# EAGLE design BEP31_Test_Interface4_Seed (EAGLE 6.4)

## Sheet 1 of 3
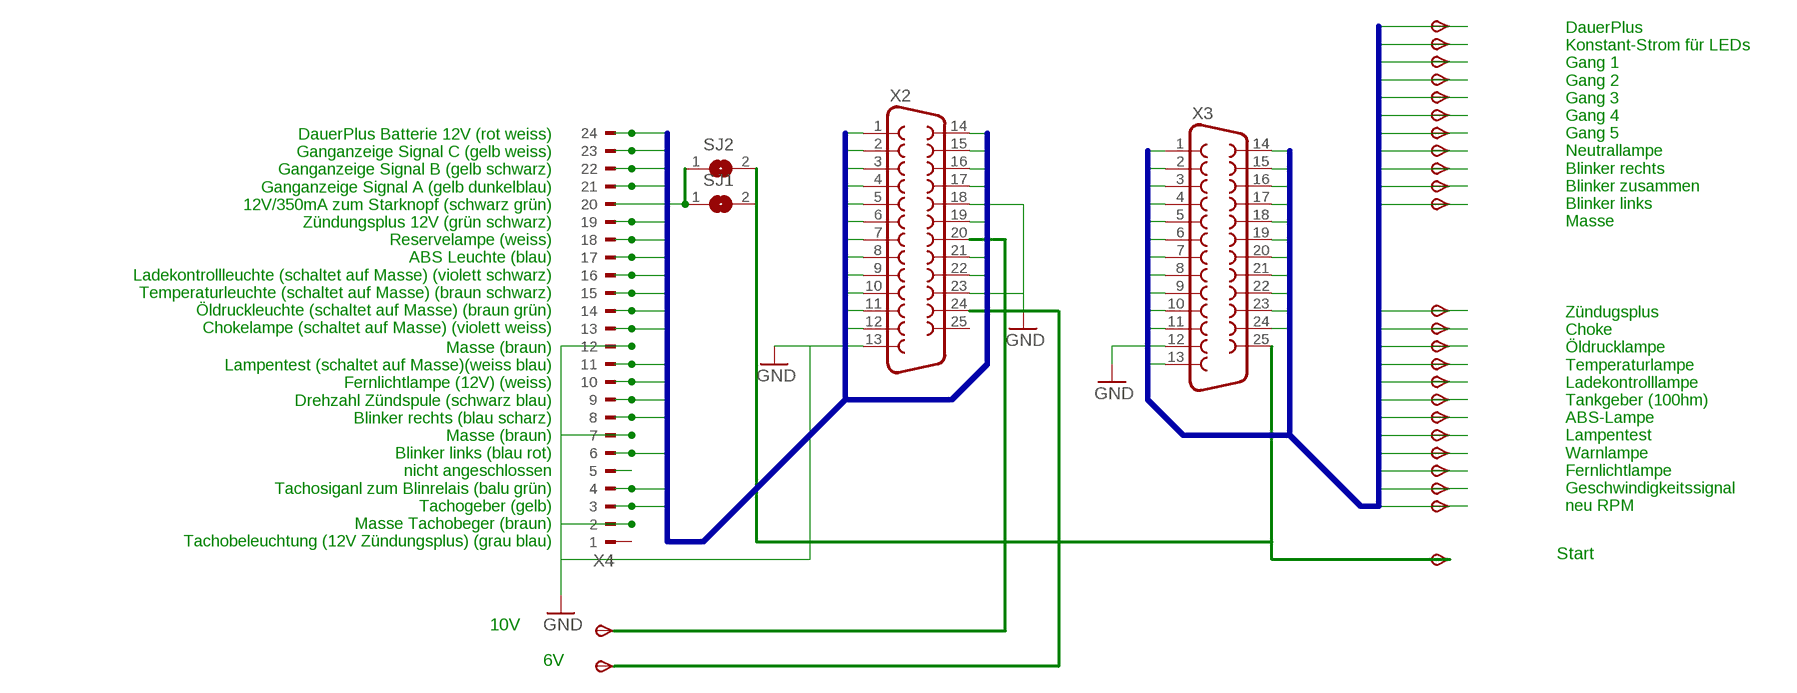
[diagram p0: schematic, sheet 1]

### Parts
SJ1  SJ  [SJ]
SJ2  SJ  [SJ]
TP1  TPSFEDERPIN  [1,36ID]
TP2  TPSFEDERPIN  [1,36ID]
TP3  TPSFEDERPIN  [1,36ID]
TP4  TPSFEDERPIN  [1,36ID]
TP5  TPSFEDERPIN  [1,36ID]
TP6  TPSFEDERPIN  [1,36ID]
TP7  TPSFEDERPIN  [1,36ID]
TP8  TPSFEDERPIN  [1,36ID]
TP9  TPSFEDERPIN  [1,36ID]
TP10  TPSFEDERPIN  [1,36ID]
TP11  TPSFEDERPIN  [1,36ID]
TP12  TPSFEDERPIN  [1,36ID]
TP13  TPSFEDERPIN  [1,36ID]
TP14  TPSFEDERPIN  [1,36ID]
TP15_10V  TPSFEDERPIN  [1,36ID]
TP16  TPSFEDERPIN  [1,36ID]
TP17  TPSFEDERPIN  [1,36ID]
TP18  TPSFEDERPIN  [1,36ID]
TP19  TPSFEDERPIN  [1,36ID]
TP20_6V  TPSFEDERPIN  [1,36ID]
TP21  TPSFEDERPIN  [1,36ID]
TP22  TPSFEDERPIN  [1,36ID]
TP23  TPSFEDERPIN  [1,36ID]
TP24  TPSFEDERPIN  [1,36ID]
TP25  TPSFEDERPIN  [1,36ID]
TP26  TPSFEDERPIN  [1,36ID]
X2  F25H  [F25H]
X3  F25H  [F25H]
X4  CON_BMWTESTPINS  [24-TESTPIN_1,36ID]

### Nets
BMW1: X2.1 X4.P24
BMW2: X2.2 X4.P23
BMW3: X2.3 X4.P22
BMW4: X2.4 X4.P21
BMW5: SJ1.1 SJ2.1 X2.5 X4.P20
BMW6: X2.6 X4.P19
BMW7: X2.7 X4.P18
BMW8: X2.8 X4.P17
BMW9: X2.9 X4.P16
BMW10: X2.10 X4.P15
BMW11: X2.11 X4.P14
BMW12: X2.12 X4.P13
BMW14: X2.14 X4.P11
BMW15: X2.15 X4.P10
BMW16: X2.16 X4.P9
BMW17: X2.17 X4.P8
BMW19: X2.19 X4.P6
BMW21: X2.21 X4.P4
BMW22: X2.22 X4.P3
BMW24: TP15_10V.P$1(PP) X2.20
GND: X2.13 X2.18 X2.23 X3.12 X4.P2 X4.P7 X4.P12 ; also sheet 3
N$1: X4.P5
N$97: SJ1.2 SJ2.2 TP14.P$1(PP) X3.25
N$100: TP20_6V.P$1(PP) X2.24
WAGO1: TP1.P$1(PP) X3.1
WAGO2: TP2.P$1(PP) X3.2
WAGO3: TP3.P$1(PP) X3.3
WAGO4: TP4.P$1(PP) X3.4
WAGO5: TP5.P$1(PP) X3.5
WAGO6: TP6.P$1(PP) X3.6
WAGO7: TP7.P$1(PP) X3.7
WAGO8: TP8.P$1(PP) X3.8
WAGO9: TP9.P$1(PP) X3.9
WAGO10: TP10.P$1(PP) X3.10
WAGO11: TP11.P$1(PP) X3.11
WAGO13: TP12.P$1(PP) X3.13
WAGO14: TP16.P$1(PP) X3.14
WAGO15: TP17.P$1(PP) X3.15
WAGO16: TP18.P$1(PP) X3.16
WAGO17: TP19.P$1(PP) X3.17
WAGO18: TP21.P$1(PP) X3.18
WAGO19: TP22.P$1(PP) X3.19
WAGO20: TP23.P$1(PP) X3.20
WAGO21: TP24.P$1(PP) X3.21
WAGO22: TP25.P$1(PP) X3.22
WAGO23: TP26.P$1(PP) X3.23
WAGO24: TP13.P$1(PP) X3.24
Unconnected: X2.25 X4.P1

### Buses
BMW[1..24]
WAGO[1..24]

### Notes on the sheet
- DauerPlus
  Konstant-Strom für LEDs
  Gang 1
  Gang 2
  Gang 3
  Gang 4
  Gang 5
  Neutrallampe
  Blinker rechts
  Blinker zusammen
  Blinker links
  Masse
- DauerPlus Batterie 12V (rot weiss)
  Ganganzeige Signal C (gelb weiss)
  Ganganzeige Signal B (gelb schwarz)
  Ganganzeige Signal A (gelb dunkelblau)
  12V/350mA zum Starknopf (schwarz grün)
  Zündungsplus 12V (grün schwarz)
  Reservelampe (weiss)
  ABS Leuchte (blau)
  Ladekontrollleuchte (schaltet auf Masse) (violett schwarz)
  Temperaturleuchte (schaltet auf Masse) (braun schwarz)
  Öldruckleuchte (schaltet auf Masse) (braun grün)
  Chokelampe (schaltet auf Masse) (violett weiss)
- Zündugsplus
  Choke
  Öldrucklampe
  Temperaturlampe
  Ladekontrolllampe
  Tankgeber (100hm)
  ABS-Lampe
  Lampentest
  Warnlampe
  Fernlichtlampe
  Geschwindigkeitssignal
  neu RPM
- Masse (braun)
  Lampentest (schaltet auf Masse)(weiss blau)
  Fernlichtlampe (12V) (weiss)
  Drehzahl Zündspule (schwarz blau)
  Blinker rechts (blau scharz)
  Masse (braun)
  Blinker links (blau rot)
  nicht angeschlossen
  Tachosiganl zum Blinrelais (balu grün)
  Tachogeber (gelb)
  Masse Tachobeger (braun)
  Tachobeleuchtung (12V Zündungsplus) (grau blau)
- Start
- 10V
- 6V

## Sheet 2 of 3
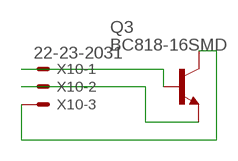
[diagram p1: schematic, sheet 2]

### Parts
Q3  BC818-16SMD  [SOT23-BEC]
X10  22-23-2031  [22-23-2031]

### Nets
N$144: Q3.B X10.1
N$145: Q3.E X10.2
N$146: Q3.C X10.3

## Sheet 3 of 3
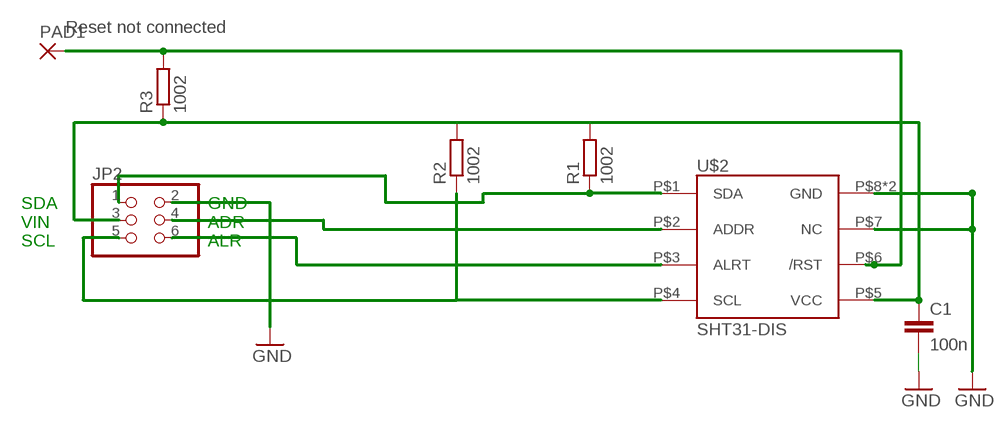
[diagram p2: schematic, sheet 3]

### Parts
C1  100n  C-EUC0805K  [C0805K]
JP2  PINHD-2X3  [2X03]
PAD1  1,6/0,8  [1,6/0,8]
R1  1002  R-EU_R0805  [R0805]
R2  1002  R-EU_R0805  [R0805]
R3  1002  R-EU_R0805  [R0805]
U$2  SHT31-DIS  [SHT3X]

### Nets
GND: C1.2 JP2.2 U$2.P$7(NC) U$2.P$8(GND) U$2.PAD(GND) ; also sheet 1
N$119: C1.1 JP2.3 R1.2 R2.2 R3.1 U$2.P$5(VCC)
N$120: JP2.5 R2.1 U$2.P$4(SCL)
N$121: JP2.1 R1.1 U$2.P$1(SDA)
N$122: JP2.4 U$2.P$2(ADDR)
N$123: JP2.6 U$2.P$3(ALRT)
N$124: PAD1.1(P) R3.2 U$2.P$6(/RST)

### Notes on the sheet
- Reset not connected
- SDA
  VIN
  SCL
- GND
  ADR
  ALR

## Library data of the parts
C1 = rcl:C-EU: CAPACITOR, European symbol
JP2 = pinhead:PINHD-2X3: PIN HEADER
PAD1 = wirepad:1,6/0,8: THROUGH-HOLE PAD
Q3 = transistor-npn:BC818*: NPN Transistor
R1-R3 = rcl:R-EU_: RESISTOR, European symbol
SJ1 SJ2 = jumper:SJ: SMD solder JUMPER
TP1-TP14 TP15_10V TP16-TP19 TP20_6V TP21-TP26 = testpin_BMW:TPS: TEST PIN
U$2 = sht31_sensirion:SHT31-DIS
X2 X3 = con-subd:F25: SUB-D; OC_FARNELL: unknown; OC_NEWARK: unknown
X4 = con_BMW:CON_BMW: BMW CONNECTOR
X10 = con-molex:22-23-2031: .100" (2.54mm) Center Header - 3 Pin; MF: MOLEX; MPN: 22-23-2031; OC_FARNELL: 1462950; OC_NEWARK: 30C0862

## Board
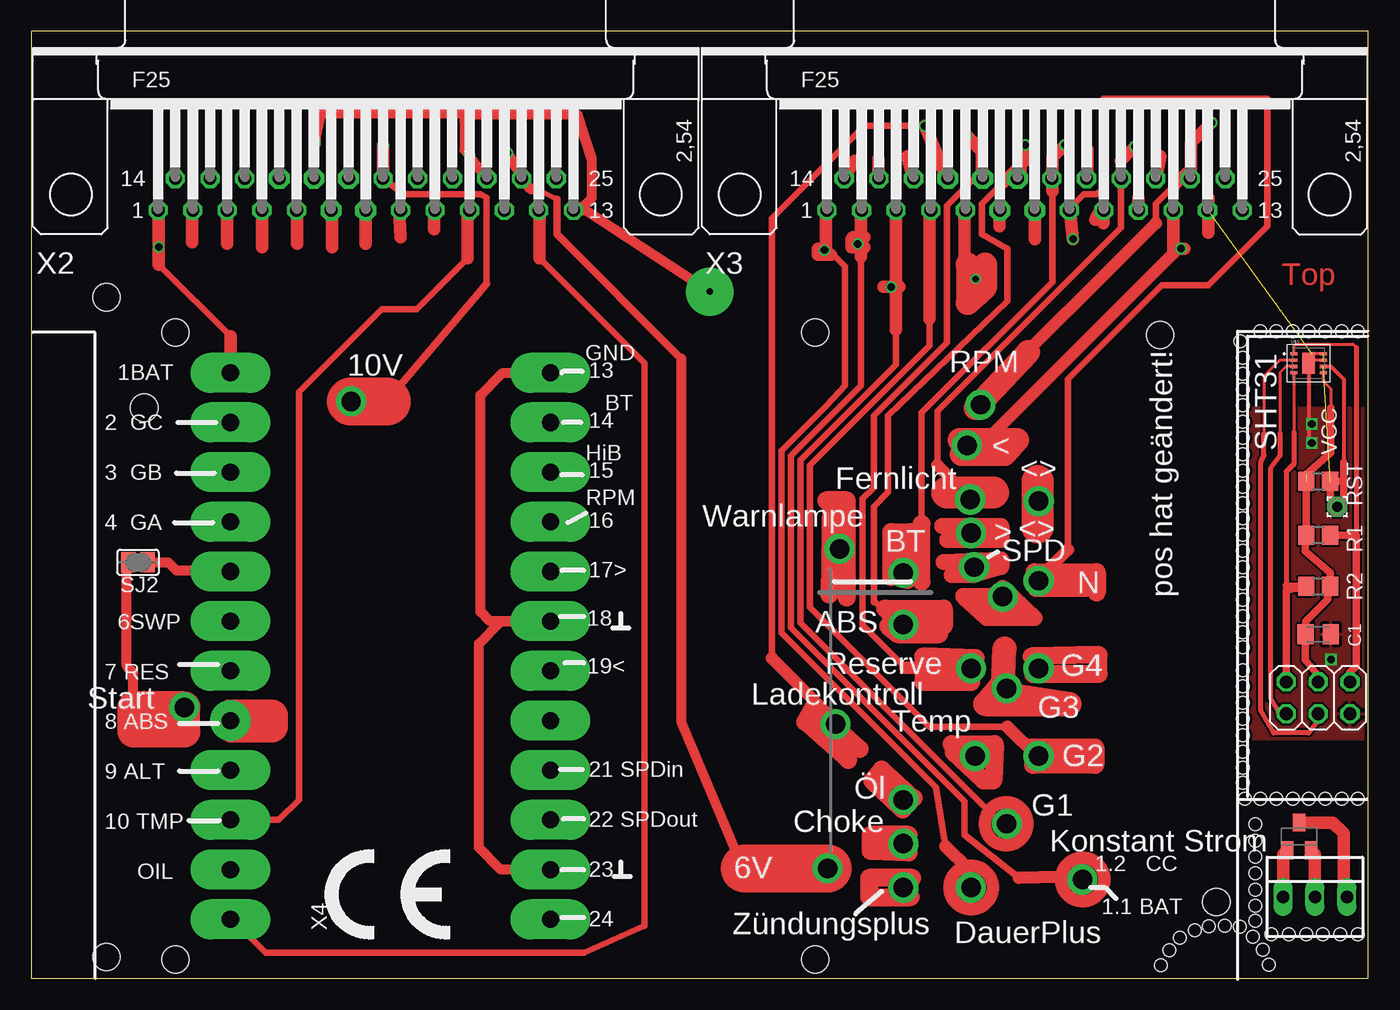
[diagram p3: board, top side]
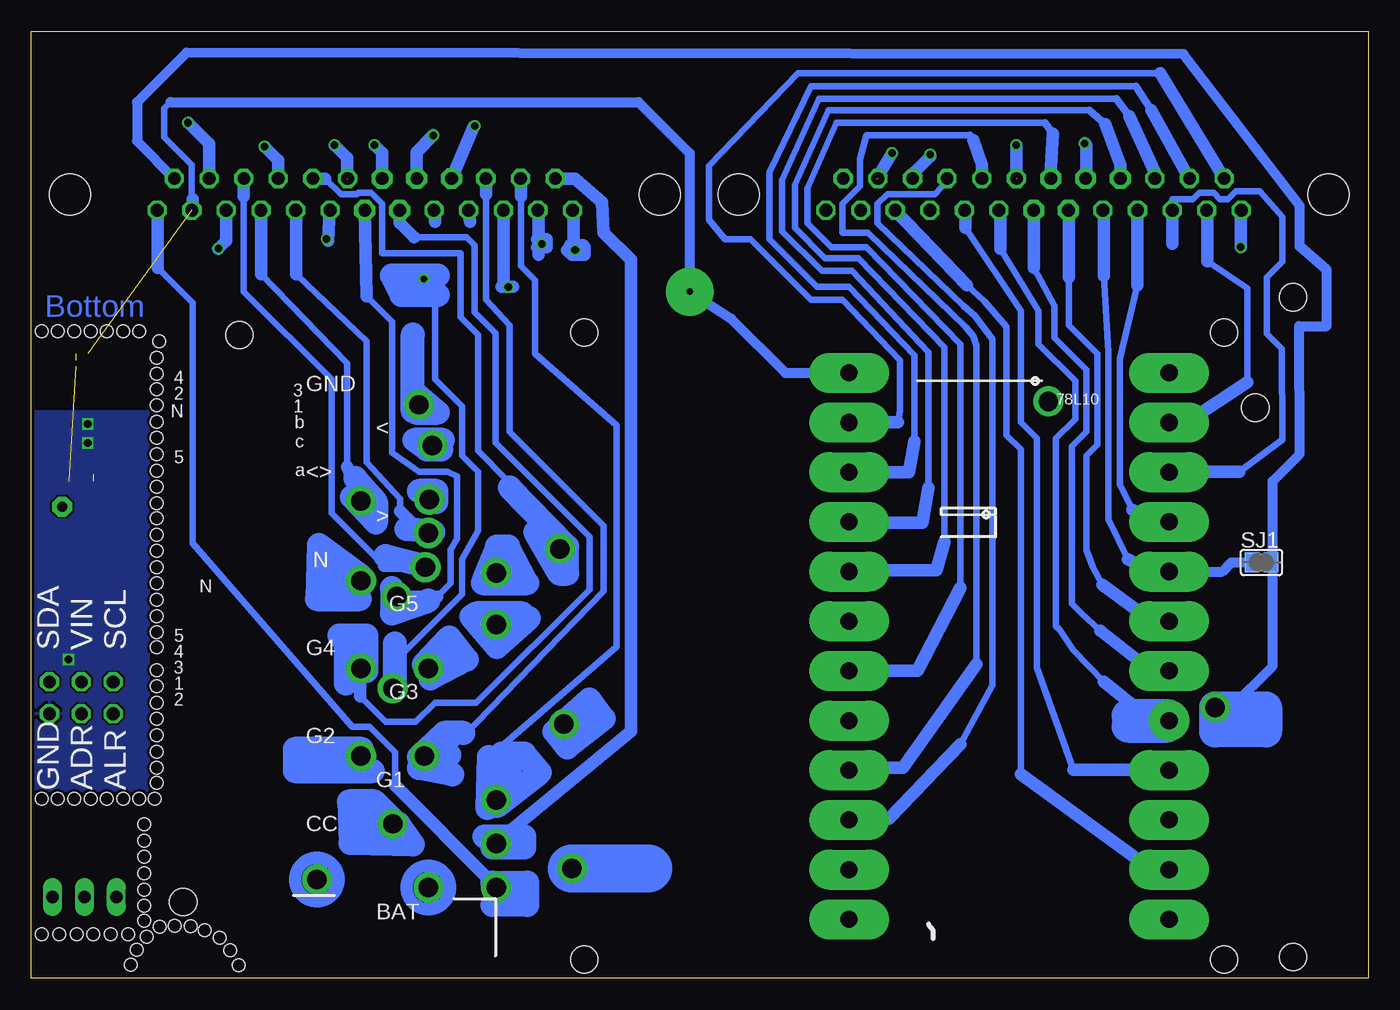
[diagram p4: board, bottom side, seen from below]

Size 106.6 x 75.5 mm. Coordinates in mm from the lower left corner, seen from the top.
Outline: 106.6,14.51 106.6,51.32
Outline: 106.6,75.5 0,75.5 0,0 106.6,0 106.6,75.5
Copper layers (1*16): Top 0.035mm / dielectric 1.5mm / Bottom 0.035mm
Design rules "SeeedStudio_2layer_DRU_no_angle_20140221": minimum track width 6mil, minimum drill 12mil, track to track 6mil, track to pad 6mil, pad to pad 6mil, via to via 6mil, smd to smd 0mil, copper to edge 10mil, drill to drill 10mil, minimum pad ring 10mil, minimum via ring 6mil, stop-mask expansion 2mil, vias tented up to drill 100mil, thermal gap 10mil
Holes 1.02 mm at 95.19,4.21 93.92,4.14 92.77,3.83 91.57,3.25 90.76,2.27 90.06,1.07 96.39,4.11 97.39,3.31 98.19,2.31 98.69,1.11 96.79,14.31 97.99,14.31 99.29,14.31 100.59,14.31 101.89,14.31 103.19,14.31 104.49,14.31 105.79,14.31 97.59,4.59 97.59,5.79 97.59,7.09 97.59,8.39 97.59,9.69 97.59,10.99 97.59,12.29 96.59,15.59 96.59,16.79 96.59,18.09 96.59,19.39 96.59,20.69 96.59,21.99 96.59,23.29 96.59,24.59 96.59,26.39 96.59,27.59 96.59,28.89 96.59,30.19 96.59,31.49 96.59,32.79 96.59,34.09 96.59,35.39 96.59,36.69 96.59,37.89 96.59,39.19 96.59,40.49 96.59,41.79 96.59,43.09 96.59,44.39 96.59,45.69 97.99,51.61 99.29,51.61 100.59,51.61 101.89,51.61 103.19,51.61 104.49,51.61 105.79,51.61 96.59,46.99 96.59,48.19 96.59,49.49 96.39,50.79 98.89,3.51 100.29,3.51 101.69,3.51 102.99,3.51 104.39,3.51 105.79,3.51
Holes 2.18 mm at 94.5,6.1 9,45.5 11.5,51.5 62.5,51.5 11.5,1.5 62.5,1.5 94.5,6.1 6,1.7 90,51.3 6,54.3
tRestrict: area 62.5,59.6 to 92.2,65; area 103.9,48.3 to 104.9,49
bRestrict: area 9.1,47.9 to 38.2,61.9; area 11.2,63.1 to 20.1,65.5; area 19,65.8 to 37.2,68.8; area 62.4,59.6 to 92.2,65.2

### Footprints (pad centres in the part's own frame; a part is rotated, then mirrored left to right if it is on the bottom)
C0805K = smd 1.3 x 1.6: 1 -1,0; 2 1,0
2X03 = drill 1.016 octagon: 1 -2.54,-1.27; 2 -2.54,1.27; 3 0,-1.27; 4 0,1.27; 5 2.54,-1.27; 6 2.54,1.27
1,6/0,8 = drill 0.813 pad 1.6 octagon: 1 0,0
SOT23-BEC = smd 1 x 1.4: B -0.95,-1.1; C 0,1.1; E 0.95,-1.1
R0805 = smd 1.3 x 1.5: 1 -0.95,0; 2 0.95,0
SJ = smd 1.168 x 1.6: 1 -0.762,0; 2 0.762,0
1,36ID = drill 1.55 pad 2.4: P$1 0,0
SHT3X = smd 0.55 x 0.25: P$1 -1.175,0.75; P$2 -1.175,0.25; P$3 -1.175,-0.25; P$4 -1.175,-0.75; P$5 1.175,-0.75; P$6 1.175,-0.25; P$7 1.175,0.25; P$8 1.175,0.75 | smd 1 x 1.7: PAD 0,0
F25H = drill 1.016 octagon: 1 -16.561,-1.27; 2 -13.792,-1.27; 3 -11.049,-1.27; 4 -8.28,-1.27; 5 -5.512,-1.27; 8 2.769,-1.27; 9 5.512,-1.27; 10 8.28,-1.27; 11 11.049,-1.27; 12 13.792,-1.27; 13 16.561,-1.27; 14 -15.189,1.27; 15 -12.421,1.27; 16 -9.652,1.27; 20 1.372,1.27; 21 4.14,1.27; 22 6.909,1.27; 23 9.652,1.27; 24 12.421,1.27; 25 15.189,1.27 | drill 1.016 pad 1.67 octagon: 6 -2.769,-1.27; 7 0,-1.27; 17 -6.909,1.27; 18 -4.14,1.27; 19 -1.372,1.27 | hole 3.302: -23.52,0; 23.52,0
24-TESTPIN_1,36ID = drill 1.36 pad 3.2 long: P1 -21.78,-12.76; P2 -17.82,-12.76; P3 -13.86,-12.76; P4 -9.9,-12.76; P5 -5.94,-12.76; P6 -1.98,-12.76; P7 1.98,-12.76; P8 5.94,-12.76; P9 9.9,-12.76; P10 13.86,-12.76; P11 17.82,-12.76; P12 21.78,-12.76; P13 -21.78,12.76; P14 -17.82,12.76; P15 -13.86,12.76; P16 -9.9,12.76; P18 -1.98,12.76; P19 1.98,12.76; P20 5.94,12.76; P21 9.9,12.76; P22 13.86,12.76; P23 17.82,12.76; P24 21.78,12.76 | drill 1.36 pad 3.2: P17 -5.94,12.76
22-23-2031 = drill 1 long: 1 -2.54,0; 2 0,0; 3 2.54,0

### Placement (x,y rotation side)
C1  102.62,27.45 0 top
JP2  102.62,22.37 180 top
PAD1  104.14,37.61 270 top
Q3  101.09,11.32 0 top
R1  102.62,35.32 180 top
R2  102.62,31.26 0 top
R3  102.62,39.64 0 top
SJ1  8.51,33.16 0 bottom
SJ2  8.51,33.16 180 top
TP1  74.93,7.26 0 bottom
TP2  83.82,7.89 0 bottom
TP3  77.79,12.34 0 bottom
TP4  80.33,17.73 0 bottom
TP5  77.79,23.13 0 bottom
TP6  80.33,24.72 0 bottom
TP7  77.47,30.43 0 bottom
TP8  80.33,31.7 0 bottom
TP9  74.93,35.51 0 bottom
TP10  80.33,38.05 0 bottom
TP11  74.61,42.5 0 bottom
TP12  69.53,7.26 0 bottom
TP13  75.69,45.74 0 bottom
TP14  12.19,21.61 0 top
TP15_10V  25.5,46 0 top
TP16  69.53,10.75 0 bottom
TP17  69.53,14.24 0 bottom
TP18  75.25,17.73 0 bottom
TP19  64.14,20.27 0 bottom
TP20_6V  63.5,8.78 0 top
TP21  74.93,24.72 0 bottom
TP22  69.53,28.21 0 bottom
TP23  69.53,32.34 0 bottom
TP24  64.45,34.24 0 bottom
TP25  74.87,38.18 0 bottom
TP26  75.18,32.78 0 bottom
U$1  [CE_10.00]  23.37,3.06 0 top
U$2  101.85,49.04 0 top
X2  26.67,62.5 0 top
X3  80.01,62.5 0 top
X4  28.64,26.5 90 top
X10  102.36,6.49 0 top

### Tracks (layer width: path | path; a pad name or v marks a point on that pad's centre or on a via)
BMW1  (via drill 0.6)
  Top 0.508: 15.88,51.2 10.16,56.91 | 10.16,61.23 X2.1
  Top 1.016: 10.16,56.91 v10.16,58.31 10.16,61.23 | X4.P24 15.88,51.2
  Bottom 1.016: 10.16,61.23 v10.16,58.31
BMW2
  Bottom 0.508: 12.83,57.17 9.65,55.01 9.65,47.51 | 14.48,44.34 15.88,44.34 X4.P23 | 12.83,61.23 X2.2
  Bottom 1.016: 12.83,57.17 12.83,61.23 | 14.48,44.34 9.65,47.51
BMW3
  Bottom 0.508: 15.62,58.56 15.62,62.12 13.97,62.12 13.46,62.63 12.32,62.63 11.81,62.12 11.18,62.12 10.54,62.75 8.64,62.75 6.86,60.72 6.86,57.14 8.1,55.9 8.1,51.4 6.9,50.2 6.86,42.94 10.29,40.4 | 15.88,40.4 X4.P22
  Bottom 1.016: 15.62,58.56 X2.3 | 15.88,40.4 10.29,40.4
BMW4
  Bottom 0.508: 18.41,55.26 19.81,49.42 19.81,39.39 18.8,37.35 | 17.4,36.47 15.88,36.47 X4.P21 | 18.41,61.23 X2.4
  Bottom 1.016: 18.41,55.26 18.41,61.23 | 17.4,36.47 18.8,37.35
BMW5  (1 unrouted)
  Top 0.813: SJ2.1 10.92,33.16 11.56,32.53 15.88,32.53
  Bottom 0.508: 19.18,33.42 20.7,36.59 20.7,49.93 21.08,56.02 | 17.4,32.53 15.88,32.53 X4.P20 | 21.08,61.23 X2.5
  Bottom 0.813: X4.P20 11.64,32.44 10.92,33.16 SJ2.1
  Bottom 1.016: 21.08,56.02 21.08,61.23 | 17.4,32.53 19.18,33.42
BMW6
  Bottom 0.508: 23.88,55.9 23.88,52.09 21.59,49.8 21.59,42.56 22.48,41.67 22.48,34.18 21.97,32.78 21.21,31.38 | 17.4,28.59 15.88,28.59 X4.P19 | 23.88,61.23 X2.6
  Bottom 1.016: 23.88,55.9 23.88,61.23 | 17.4,28.59 21.21,31.38
BMW7
  Bottom 0.508: 26.67,56.66 25.02,53.61 25.02,51.07 22.48,48.53 22.48,43.58 23.62,42.43 23.62,29.86 22.86,29.1 21.34,27.7 | 17.27,24.53 X4.P18
  Bottom 1.016: 26.67,56.66 X2.7 | 17.27,24.53 21.34,27.7
BMW8
  Bottom 0.508: 29.34,58.18 26.29,53.23 26.29,50.56 23.37,47.64 23.37,44.59 24.89,43.07 24.89,28.08 24.64,27.83 23.5,26.18 21.08,23.64 | 17.27,20.59 15.88,20.59 X4.P17 | 29.34,61.23 X2.8
  Bottom 1.016: 29.34,58.18 29.34,61.23 | 17.27,20.59 21.08,23.64
  Bottom 2.54: 15.88,20.59 15.88,20.97 19.18,20.97 19.18,20.08 16,20.08 16,20.21
BMW9
  Bottom 0.508: 32.13,59.83 27.69,53.23 27.69,44.34 26.42,43.07 26.42,24.78 23.5,16.65 | 17.27,16.65 15.88,16.65 X4.P16 | 32.13,61.23 X2.9
  Bottom 1.016: 32.13,59.83 32.13,61.23 | 17.27,16.65 23.5,16.65
BMW10
  Top 0.508: X4.P15 19.74,12.64 21.34,14.24 21.34,46.75 27.94,53.36 30.73,53.36 34.8,57.42 | 34.8,61.08 X2.10
  Top 1.016: 34.8,57.42 34.8,61.08
BMW11
  Bottom 0.508: 32,55.26 30.61,53.99 28.83,51.96 28.83,43.32 27.69,42.18 27.69,16.27 | 17.4,8.78 15.88,8.78 X4.P14
  Bottom 1.016: 32,55.26 X2.11 | 17.4,8.78 27.69,16.27
BMW12
  Top 0.508: 40.51,57.42 48.9,49.04 48.9,4.21 44.07,2.05 18.67,2.05 15.88,4.84 X4.P13 | 40.51,61.23 X2.12
  Top 1.016: 40.51,57.42 40.51,61.23
BMW14
  Bottom 0.508: 37.48,44.32 37.34,45.23 37.34,49.29 41.91,54.12 44.45,54.12 49.28,58.94 51.31,58.94 52.58,60.47 52.58,64.79 45.47,72.15 16.56,72.15
  Bottom 1.016: X4.P11 37.48,44.32 | 16.56,72.15 X2.14
BMW15
  Bottom 0.508: 36.2,42.81 36.2,49.67 41.4,55.13 43.94,55.13 47.75,58.94 47.75,64.28 44.45,71.14 18.54,71.14
  Bottom 0.61: 18.54,71.14 17.27,69.23
  Bottom 1.016: X4.P10 36.62,40.36 36.2,42.81 | 17.27,69.23 X2.15
BMW16
  Bottom 0.508: 20.07,70.12 43.81,70.12 46.74,63.64 46.74,59.58 43.56,56.4 41.15,56.4 35.05,49.93 35.05,39.13 | 41.33,36.34 X4.P9
  Bottom 0.61: 19.05,68.72 20.07,70.12
  Bottom 1.016: X2.16 17.02,64.28 19.05,68.72 | 35.05,39.13 35.56,36.34 41.33,36.34
BMW17
  Bottom 0.508: 22.23,69.23 43.05,69.23 45.72,63.26 45.72,59.83 43.31,57.42 40.64,57.42 33.78,50.31 33.78,34.81 | 41.4,32.53 41.78,32.15 41.69,32.15 X4.P8
  Bottom 0.61: 20.95,68.09 22.23,69.23
  Bottom 1.016: X2.17 19.76,64.86 20.95,68.09 | 33.78,34.81 34.42,32.53 41.4,32.53
BMW19
  Bottom 0.508: 25.78,68.22 42.42,68.22 44.7,63.01 44.7,60.21 42.8,58.31 40.01,58.31 32.51,50.56 32.51,31.13 | 41.39,24.53 X4.P6
  Bottom 0.61: 25.15,67.33 25.78,68.22
  Bottom 1.016: X2.19 25.3,64.68 25.15,67.33 | 32.51,31.13 35.94,24.53 41.39,24.53
BMW21
  Bottom 0.508: 31.75,67.2 40.01,67.2 40.51,65.29 40.51,63.14 41.91,61.74 41.91,59.45 39.88,59.45 32.13,51.96 31.5,51.2 31.24,50.44 31.24,25.04 | 41.22,16.78 X4.P4
  Bottom 0.61: 31.5,66.82 31.75,67.2
  Bottom 1.016: X2.21 30.81,64.86 31.5,66.82 | 31.24,25.04 37.08,16.78 41.22,16.78
BMW22
  Bottom 0.406: 33.53,63.77 33.53,63.64
  Bottom 0.508: 32.51,18.68 29.97,23.38 29.97,50.94 31.37,52.85 32.26,53.61 39.12,60.21 39.12,61.74 38.35,62.5 34.54,62.5 33.53,63.64 | 33.53,63.77 X2.22
  Bottom 1.016: 32.51,18.68 38.23,12.72 X4.P3
BMW24  (via drill 0.6)  (1 unrouted)
  Top 0.508: 28.07,63.77 28.19,63.64 29.72,62.5 35.81,62.5 36.32,62.25 36.32,55.39
  Top 0.61: 28.33,46 36.32,55.39
  Top 1.016: v28.07,66.44 28.07,63.77
  Top 3.81: TP15_10V.P$1 28.33,46
  Bottom 1.016: 28.04,63.8 v28.07,66.44
GND  (via drill 0.51 pad 3.81, 0.6)  (2 unrouted)
  Top 0.254: U$2.P$7 102.1,49.29 U$2.PAD | U$2.P$8 102.12,49.79 102.11,49.8
  Top 0.305: U$2.PAD 101.85,42.69 v102.11,42.69
  Top 0.813: X4.P2 37.44,8.68 35.69,10.43 35.69,26.69 37.47,28.46 41.38,28.46 X4.P7 36.56,28.48 35.81,29.23 35.81,46.5 37.59,48.28 X4.P12 | 34.54,68.34 34.8,68.85 43.56,68.85 44.7,65.29 44.7,62.25 43.69,61.23 X2.13 44.2,61.23 v54.1,54.75 | 34.54,68.34 34.54,66.06 X2.23 | X2.18 22.53,66.23 23.11,68.98 35.05,68.98 34.54,68.34
  Bottom 0.508: X3.12 93.8,64.86 96.01,67.07 96.01,69.36 95.5,69.87
  Bottom 0.813: X4.P12 46.48,48.28 50.8,52.59 v54.1,54.75 54.1,65.8 58.17,69.87 95.5,69.87
  other vias: 103.63,25.42 102.11,44.21
  pour Top: 106.17,45.48 106.17,19.07 97.03,19.07 97.03,45.48
  pour Bottom: 106.68,14.49 106.68,45.23 97.28,45.23 97.28,14.49
N$6
  Top 0.508: 73.15,63.77 73.03,63.77
  Top 1.016: 73.03,63.77 71.25,67.96
N$7
  Top 0.508: 78.74,63.77 78.87,63.77
  Top 1.016: 78.87,63.77 78.87,66.31
N$20  (1 unrouted)
  Top 1.016: 82.8,61.23 83.06,58.94
  Bottom 1.016: 82.8,61.36 82.8,61.23 82.93,58.82
N$21
  Top 1.016: 85.47,61.23 85.47,60.21
N$22
  Top 1.016: 85.34,61.36 84.84,60.47
N$23
  Top 1.016: 67.56,63.77 67.56,65.29
N$24
  Top 1.016: 64.77,63.77 65.66,65.17
N$25
  Top 1.016: 84.2,63.77 84.2,66.06
N$26
  Top 1.016: 88.27,61.23 88.27,62.25
N$27
  Top 1.016: 77.22,61.23 77.22,59.96
N$28
  Bottom 1.016: 63.37,61.23 63.37,58.31
N$29
  Bottom 1.016: 66.17,61.23 66.17,57.67
N$30
  Bottom 1.016: 71.75,61.23 71.63,60.34
N$31
  Bottom 1.016: 74.42,61.23 74.42,60.34
N$32
  Top 1.016: 12.83,61.23 12.83,58.69
N$33
  Top 1.016: 15.62,61.1 15.62,58.56
N$34
  Top 1.016: 18.41,61.23 18.41,58.31
N$35
  Top 1.016: 21.21,61.23 21.21,58.56
N$36
  Top 1.016: 24,61.23 24,58.31
N$37
  Top 1.016: 26.67,61.1 26.67,58.56
N$38
  Top 1.016: 29.34,61.23 29.46,59.07
N$39
  Top 1.016: 32.13,61.23 32.13,59.71
N$41
  Top 1.422: 66.04,18.3 62.36,21.61 61.72,20.46 65.15,17.41
N$42
  Top 1.422: 79.76,18.43 84.84,18.43 84.84,17.03 79.88,17.03
N$43
  Top 1.422: 70.36,14.37 67.82,16.65 67.06,15.76 69.47,13.48
N$44
  Top 1.422: 69.98,11.45 66.93,11.45 66.93,10.18 69.98,10.05
N$45
  Top 1.422: 70.23,8.02 66.8,8.02 66.8,6.49 70.1,6.49
N$46
  Top 1.422: 79.88,24.27 85.09,24.27 85.09,25.8 79.76,25.67
N$47
  Top 1.422: 75.31,25.54 71.12,25.67 71.12,23.64 74.93,23.64
N$48
  Top 1.422: 80.01,32.4 84.96,32.4 84.96,30.75
N$49
  Top 1.422: 80.14,31.13 84.07,31.13
N$50
  Top 1.422: 73.41,18.68 76.83,18.68 76.71,15.76 75.95,15.76 73.53,18.05
N$51
  Top 1.422: 68.07,29.48 72.77,29.48 72.77,28.08 68.33,28.08 69.09,27.45 72.39,27.45
N$52
  Top 1.422: 68.58,32.02 68.58,35.58 70.1,35.58
N$53
  Top 1.422: 69.85,31.77 69.85,35.45
N$54
  Top 1.422: 65.02,30.37 65.02,38.12 63.75,38.12 | 63.75,38.12 63.37,38.12 | 63.75,38.12 63.63,30.62
N$55
  Top 2.54: 80.26,35.96 80.26,39.64
N$56
  Top 2.54: 73.03,38.75 76.71,38.75
N$57
  Top 1.27: 72.64,36.08 77.34,36.08 77.34,34.94 73.03,34.94
N$58
  Top 1.27: 72.77,33.22 77.34,33.42 77.34,32.78 75.18,32.15 73.41,32.15
N$59
  Top 1.27: 77.47,31.13 80.01,28.72 76.2,28.72 74.42,30.37 78.36,29.61
N$60
  Top 1.27: 74.3,30.5 76.96,30.5
N$61
  Bottom 1.93: 75.44,17.8 73.28,17.8
N$63
  Bottom 1.93: 73.03,16.27 75.69,16.78
N$64
  Bottom 1.93: 70.48,11.32 67.31,11.32 67.31,10.43 69.85,10.43
N$65
  Bottom 1.93: 77.85,12.72 79.25,14.11 81.28,14.11 81.15,10.81 76.2,10.68 77.34,12.34 79.12,12.46
N$67
  Bottom 1.93: 69.47,13.73 66.04,16.4 67.31,17.92 69.09,17.92 68.07,15.51
N$70
  Bottom 1.93: 70.23,13.61 70.1,17.67
N$71
  Bottom 1.93: 64.26,20.34 62.1,22.24 60.96,20.72 63.88,18.43 64.9,19.7
N$72
  Bottom 1.93: 79.88,24.53 79.88,27.32 82.04,27.32 81.53,26.81 81.53,23.51
N$73
  Bottom 1.93: 75.31,25.04 73.28,27.19 71.88,25.42 74.8,23.89
N$74
  Bottom 1.93: 77.6,23 77.6,26.69
N$76
  Bottom 1.93: 80.14,13.1 80.14,11.57
N$77
  Bottom 1.93: 80.26,18.3 85.6,18.3 85.6,16.53 79.38,16.53
N$78
  Bottom 1.93: 74.93,32.78 78.36,33.67
N$79
  Bottom 1.93: 80.39,32.15 83.69,34.56 83.82,30.24 80.39,30.24 82.68,32.02
N$80
  Bottom 1.93: 77.85,31.13 77.85,29.1 74.93,30.11
N$81
  Bottom 1.93: 80.77,39.89 79.12,37.99 79.12,36.34 81.03,38.37
N$82
  Bottom 1.93: 74.55,35.58 76.71,35.83
N$83
  Bottom 1.93: 74.3,37.99 74.3,38.88 75.69,38.88
N$84
  Bottom 1.93: 67.44,29.1 71.12,29.1 71.5,28.84 69.47,26.43 66.93,28.72
N$85
  Bottom 1.93: 70.61,31.51 67.06,31.51 68.58,34.43 69.47,34.43 70.48,31.89
N$86
  Bottom 1.93: 66.42,35.58 64.52,32.27 63.88,32.27 63.88,34.43 68.45,39.13
N$87
  Bottom 1.93: 72.14,19.57 73.66,19.57 75.69,17.67
N$88
  Bottom 1.93: 73.79,42.94 76.07,42.94 75.06,42.18 73.91,42.18
N$89
  Bottom 1.93: 75.95,45.1 74.17,45.1 75.82,46.5
N$90
  Bottom 1.93: 76.2,45.23 76.2,51.32
N$91
  Bottom 1.93: 74.17,56.02 77.85,56.02 77.09,54.5 74.17,54.5
N$92
  Top 1.93: 74.68,56.91 74.68,53.86 76.07,55.13 76.07,56.91
N$93
  Top 1.93: 75.31,45.48 79.5,49.93
N$94
  Top 1.93: 74.04,42.94 78.61,42.94 77.6,41.8 74.17,41.8
N$95
  Top 1.93: 77.47,23 77.6,26.3
N$96
  Top 1.93: 77.34,23.38 76.07,21.86 82.8,21.86 78.61,22.5
N$97  (1 unrouted)
  Top 0.813: 8.13,19.7 8.13,24.4 7.62,24.91 7.62,33.04 SJ2.2
  Top 2.54: TP14.P$1 8.13,21.61 8.13,19.7 12.19,19.7 TP14.P$1
  Bottom 0.813: TP14.P$1 10.92,21.61 7.62,24.91 7.62,39.64 5.46,41.8 5.5,52 3.3,52 3.3,56.5 5.46,58.36 5.46,61.61 14.73,73.68 94.23,73.8 98.17,69.87 98.17,66.74 X3.25
  Bottom 2.54: TP14.P$1 8.13,21.61 8.13,19.7 12.19,19.7 TP14.P$1
N$98
  Top 2.54: 16,20.59 15.88,20.59 15.88,20.97 16,20.97 | 16,20.97 19.18,20.97 19.18,20.08 16,20.08 16,20.97
N$99
  Bottom 1.016: 66.29,58.94 65.53,58.94 65.53,58.31 66.29,58.31
N$100  (via drill 0.6)  (1 unrouted)
  Top 0.406: 41.91,62.12 40.89,62.63 39.85,62.88
  Top 0.61: 41.91,62.12 41.91,59.33 51.82,49.42
  Top 0.813: 51.82,49.42 51.82,20.46 56.64,9.03 56.9,8.78 | 39.06,63.95 38.18,65.5 v37.97,65.8 | 39.85,62.88 X2.24
  Top 3.81: 56.9,8.78 TP20_6V.P$1
  Bottom 1.016: 39.19,63.69 v37.97,65.8
  Bottom 3.81: TP20_6V.P$1 57.4,8.78
N$101  (via drill 0.6)
  Top 1.016: v22.61,66.56 22.61,68.47 22.99,68.85
  Bottom 1.016: 22.48,63.77 22.48,66.44 v22.61,66.56
N$102
  Bottom 1.016: 36.2,63.77 36.2,64.28 34.92,65.55
N$103  (via drill 0.6)
  other vias: 34.92,65.67
N$104
  Bottom 1.016: 93.73,61.23 93.73,62.12
N$105
  Top 1.016: 93.85,62.25 93.85,59.45
N$106  (via drill 0.6)
  Bottom 1.016: 91.06,61.36 91.06,58.82 v91.69,58.18
N$107  (via drill 0.6)
  other vias: 83.06,58.94
N$108  (via drill 0.6)
  other vias: 68.58,55.13
N$109
  Bottom 1.016: 68.2,55.13 69.09,55.13
N$110
  Top 1.016: 67.94,55.13 69.22,55.13
N$111  (via drill 0.6)
  other vias: 65.91,58.56
N$112  (via drill 0.6)
  other vias: 63.25,58.05
N$113
  Top 1.016: 63.37,58.18 62.74,58.18 62.74,57.67 63.75,57.67
N$114
  Bottom 1.016: 63.63,58.44 62.61,58.44 62.48,58.31 62.48,57.67 63.5,57.67 63.88,58.05
N$115
  Top 1.016: 66.42,59.07 65.53,59.07 65.41,58.94 65.41,58.31 66.42,58.31
N$119  (1 unrouted)
  Top 0.254: U$2.P$5 103.04,48.28 103.04,47.69 arc45 103.1,47.53 103.63,47.01 103.63,45.48
  Top 0.61: JP2.3 102.62,24.15 101.6,25.42 101.6,27.43 C1.1 101.62,28.48 103.38,30.24 103.38,31.07 R2.2 103.57,32.34 101.6,34.05 101.6,35.13 R1.2 101.67,40.21 103.63,41.93 103.63,45.48
N$120
  Top 0.254: U$2.P$4 100.68,43.55
  Top 0.406: 100.68,43.55 100.68,41.01 100.08,40.4 100.08,31.32
  Top 0.61: JP2.5 100.08,30.94 R2.1 100.08,31.32
N$121
  Top 0.254: U$2.P$1 100.68,50.4 100.84,50.56 105.41,50.56 105.66,50.31
  Top 0.406: 105.66,50.31 105.66,35.32
  Top 0.61: JP2.1 105.16,24.4 105.66,24.91 105.66,35.32 R1.1
N$122
  Top 0.254: U$2.P$2 99.56,49.29 98.3,48.02 98.3,43.45
  Top 0.406: 102.62,20.59 101.85,19.57 99.06,19.57 98.04,21.35 98.04,41.16 98.3,41.67 98.3,43.45
  Top 0.61: JP2.4 102.62,20.59
N$123
  Top 0.254: U$2.P$3 100.08,48.79 99.57,48.28 99.57,43.45
  Top 0.406: 99.57,21.1 98.81,22.37 98.81,40.66 99.57,41.67 99.57,43.45
  Top 0.61: JP2.6 99.57,21.1
N$124  (1 unrouted)
  Top 0.305: U$2.P$6 103.63,48.79 103.63,48.78
  Top 0.61: PAD1.1 103.57,38.18 R3.2 104.65,39.64
N$125
  Top 0.305: 103.63,48.78 104.65,47.77 104.65,41.16
  Top 0.61: 104.14,37.61 104.65,38.12 104.65,41.16
N$144
  Top 1.016: X10.1 99.82,9.9 Q3.B
N$145
  Top 1.016: X10.2 102.36,9.9 Q3.E
N$146
  Top 1.016: Q3.C 103.8,12.42 104.65,11.57 104.65,6.75 X10.3
WAGO1
  Top 0.508: 63.37,58.31 64.9,56.78 64.9,47.26 63.37,45.61 59.82,42.05 59.82,27.57 72.14,15.26 72.9,10.56 | 74.68,8.78 74.68,7.51 TP1.P$1 | 63.37,61.23 X3.1
  Top 1.016: 63.37,58.31 63.37,61.23 | 74.68,8.78 72.9,10.56
WAGO2
  Top 0.508: 66.17,57.55 66.17,47.26 60.58,41.67 60.58,27.96 74.42,14.11 74.42,11.45 78.74,8.02 | TP2.P$1 83.57,8.14 | 66.17,61.23 X3.2
  Top 1.016: 66.17,57.55 66.17,61.23 | 83.57,8.14 78.74,8.02
WAGO3
  Top 0.508: 68.96,51.7 68.96,48.91 61.34,41.29 61.34,28.34 77.34,12.34 TP3.P$1
  Top 1.016: 68.96,51.7 X3.3
  Bottom 1.016: X3.3 68.96,55.26
WAGO4
  Top 0.508: 71.63,52.59 71.63,50.44 62.1,40.91 62.1,29.61 71.63,20.08 77.85,20.08 | 71.63,61.23 X3.4 | 80.26,17.67 TP4.P$1
  Top 1.016: 71.63,52.59 71.63,61.23 | 80.26,17.67 77.85,20.08
WAGO5  (via drill 0.51)
  Top 0.508: 74.42,61.23 X3.5
  Top 1.016: v75.31,55.77 75.31,56.53 74.42,57.42 74.42,61.23
  Bottom 0.508: 74.42,54.12 74.42,47.77 72.26,45.61 72.26,41.67 70.99,40.4 70.99,35.7 72.26,33.42 72.26,30.62 77.72,25.16 | 77.72,23.13 TP5.P$1
  Bottom 1.016: 74.42,54.12 75.31,55.01 v75.31,55.77 | 77.72,23.13 77.72,25.16
WAGO6
  Bottom 0.508: 76.07,59.07 71.88,59.07 71.25,58.44 71.25,53.1 69.6,51.45 69.6,42.69 62.1,35.2 62.1,31 71.12,21.99 74.42,21.99 75.95,20.46 78.36,20.46 80.39,22.5 | 80.39,24.65 TP6.P$1
  Bottom 1.016: X3.6 77.24,60.24 76.07,59.07 | 80.39,22.5 80.39,24.65
WAGO7
  Top 1.016: X3.7 80.01,58.94
  Bottom 0.508: 79.88,54.37 77.85,52.34 77.85,41.93 75.69,40.4 73.41,40.4 72.64,40.02 72.64,35.07 73.15,34.18 73.15,31.51 74.23,30.43
  Bottom 1.016: 79.88,54.37 X3.7 | 74.23,30.43 TP7.P$1
WAGO8
  Top 0.508: 80.26,31.77 TP8.P$1 | 82.68,61.23 82.74,61.29 | 82.74,61.29 83.95,62.5 84.96,62.5 85.47,63.01 85.47,70.12 98.55,70.12 98.55,59.96 93.85,55.26 90.17,55.26 82.68,47.77 82.68,34.18 | X3.8 82.8,61.23 82.74,61.29
  Top 1.016: 80.26,31.77 82.68,34.18
WAGO9
  Bottom 0.508: 85.47,56.15 79.88,50.82 79.88,41.16 77.22,38.24 77.22,37.23 | 75.56,35.58 74.93,35.58 TP9.P$1 | 85.47,61.23 X3.9
  Bottom 1.016: 85.47,56.15 85.47,61.23 | 75.56,35.58 77.22,37.23
WAGO10
  Bottom 0.508: 88.27,56.15 81.41,49.04 81.41,40.78 | 80.39,38.37 80.39,38.12 TP10.P$1 | 88.27,61.23 X3.10
  Bottom 1.016: 88.27,56.15 88.27,61.23 | 80.39,38.37 81.41,40.78
WAGO11
  Top 0.508: 74.68,42.43 TP11.P$1
  Top 1.016: 91.06,58.18 91.06,57.8 75.69,42.43 74.68,42.43 | 91.06,58.18 X3.11 | 91.95,58.18 91.06,58.18
WAGO13
  Bottom 0.508: 96.52,56.66 93.73,53.86 93.73,34.69 81.03,20.08 79.63,20.08 77.6,18.05 77.6,15.38 | 96.52,61.23 X3.13 | 69.47,7.26 TP12.P$1
  Bottom 1.016: 96.52,56.66 96.52,61.23 | 69.47,7.26 69.85,7.64 77.6,15.38
  Bottom 1.93: 69.85,7.64 67.06,7.64 67.06,5.86 69.85,5.86
WAGO14
  Bottom 0.508: 69.6,10.81 TP16.P$1
  Bottom 0.992: 58.8,19.7 58.8,57.29
  Bottom 1.016: X3.14 63.25,63.77 61.09,61.87 60.96,59.45 58.8,57.29 | 69.6,10.81 58.8,19.7
WAGO15
  Bottom 0.508: 67.56,62.37 67.56,56.78 66.42,55.64 66.42,49.8 59.94,44.09 59.94,26.43 69.47,18.18 | 67.56,63.77 X3.15 | 69.47,14.24 TP17.P$1
  Bottom 1.016: 67.56,62.37 67.56,63.77 | 69.47,14.24 69.47,18.18
WAGO16
  Top 1.016: X3.16 69.85,65.55
  Bottom 0.508: 70.36,62.5 70.36,54.12 68.45,52.09 68.45,43.58 60.96,36.08 60.96,30.88 72.26,19.19 73.66,17.8 | 75.31,17.8 TP18.P$1
  Bottom 1.016: 70.36,62.5 X3.16 | 75.31,17.8 73.66,17.8
WAGO17  (via drill 0.6)
  Top 0.508: 59.05,25.54 59.05,60.59 66.42,67.96 v71.25,67.96 | TP19.P$1 64.14,20.46
  Top 1.016: 64.14,20.46 59.05,25.54
  Bottom 0.508: 71.32,67.89 v71.25,67.96
  Bottom 1.016: X3.17 71.32,67.89
WAGO18  (via drill 0.6)
  Top 0.508: 75.82,64.41 73.03,61.61 73.03,50.69 67.18,44.85 67.18,39.13 66.29,38.24 66.29,28.21 69.72,24.78 | 74.93,24.78 TP21.P$1
  Top 1.016: 74.93,24.78 69.72,24.78 | v74.55,67.2 75.82,65.93 75.82,64.41
  Bottom 1.016: X3.18 75.87,65.88 v74.55,67.2
WAGO19  (via drill 0.6)
  Top 0.508: 77.53,63.45 75.82,61.74 75.82,59.33 77.85,58.18 77.85,53.99 68.33,44.85 68.33,38.75 67.18,37.61 67.18,29.99 67.31,29.99 67.94,29.35 | 69.47,27.7 69.47,28.21 TP22.P$1
  Top 1.016: 77.53,63.45 77.85,63.77 79.25,65.17 v79.25,66.44 | 69.47,27.7 67.94,29.35
  Bottom 1.016: X3.19 78.64,65.83 v79.25,66.44
WAGO20  (via drill 0.6)  (1 unrouted)
  Top 0.508: 70.99,34.05 70.99,36.21 70.99,45.1 81.41,55.52 81.41,62.75 | 69.6,32.66 69.6,32.4 TP23.P$1
  Top 1.016: 69.6,32.66 70.99,34.05 | v82.42,66.44 81.41,65.42 81.41,62.75
  Top 1.422: 70.99,31.64 70.99,36.21
  Bottom 1.016: 81.41,63.77 81.41,65.42 v82.42,66.44
WAGO21
  Bottom 0.508: 83.19,63.77 81.92,62.5 80.64,62.5 80.52,62.63 79.5,62.63 78.61,61.74 78.61,57.8 72.39,57.8 72.39,52.72 70.99,51.32 70.99,42.05 68.71,39.77 68.71,38.88 | 64.39,34.31 TP24.P$1
  Bottom 1.016: 83.19,63.77 X3.21 | 64.39,34.31 65.28,35.45 68.71,38.88
WAGO22  (via drill 0.6)
  Top 0.508: 72.26,40.91 72.26,45.23 86.87,59.83 86.87,62.63 86.87,65.17 | 74.93,38.24 TP25.P$1
  Top 1.016: 74.93,38.24 72.26,40.91 | v88.01,66.31 86.87,65.17
  Bottom 1.016: X3.22 86.92,65.22 v88.01,66.31
WAGO23
  Top 1.016: X3.23 90.04,65.55
  Bottom 0.508: 89.66,62.37 89.66,54.75 82.68,47.77 82.68,37.1 78.49,32.91 | TP26.P$1 75.31,32.91
  Bottom 1.016: 89.66,62.37 X3.23 | 75.31,32.91 78.49,32.91
WAGO24  (via drill 0.6)
  Top 0.508: 91.19,63.26 89.66,61.74 89.66,60.21 | TP13.P$1 75.69,46.24
  Top 1.016: 91.19,63.26 92.46,64.53 92.46,66.56 v94.11,68.22 | 75.69,46.24 89.66,60.21
  Bottom 1.016: X3.24 92.43,66.54 v94.11,68.22
(copper drawn outside any net)
  shapes: Bottom circle x2, Top circle x3

### Text on the board
Top: Top
Bottom: Bottom
bPlace: 4 | 3 | 2 | 1 | b | c | 5 | a | 5 | 4 | 3 | 1 | 2
tNames: SHT31 | 10V | RPM | VCC | < | GND / BT / HiB | RST | <> | RPM | Fernlicht | Warnlampe | > | <> | BT | SPD | N | pos hat geändert! | 18 | ABS | 19< | Reserve | G4 | Ladekontroll | Start | G3 | Temp | G2 | Öl | G1 | Choke | Konstant Strom | 1.2 CC | 6V | 1.1 BAT | 1BAT / 2 GC / 3 GB / 4 GA / / 6SWP / 7 RES / 8 ABS / 9 ALT / 10 TMP / OIL | Zündungsplus | DauerPlus | 13 / 14 / 15 / 16 / 17> / / / / 21 SPDin / 22 SPDout / 23 / 24
bNames: 78L10 | N | N | SDA / VIN / SCL | GND / ADR / ALR | < / / > / / G5 / / G3 / / G1 / / / BAT | GND / / <> / / N / / G4 / / G2 / / CC
bValues: BA | BA | 6,8 | 2.4V/1.1V | 4 | 13 GND / 14 BT / 15 HiB / 16 RPM / 17 > / 18 GND / 19 < / / 21 SPD in / 22 SPD o / 23 GND | SPD / / WRN / / ABS / / ALT / / OIL / / SWP | RPM / / HiB / / BT / / BAR / / TMP / / CHK | BA | BA | 1 BAT / 2 GC / 3 GB / 4 GA / 5 START / 6 SWP / 7R ES / 8A BS / 9 / 10 TMP / 11 OIL / 12CH K